# Altium schematic sheet Dual VCO schematic Thijn en Ralph.SchDoc: Dual VCO
size A4; Author: Thijn Berkhoff; DrawnBy: Thijn Berkhoff; SheetNumber: 1; SheetTotal: 1; SPICEModelCacheYZOSSGZK: <root> / <DocumentId>YZOSSGZK</DocumentId> / <CacheFrame Number="0"> / <Model Name="bc847c" Kind="CKT"> / <Text>********************************************************** / * / * BC847C / * / * Nexperia / * / * General purpose NPN transistor / * IC   = 100 mA / * VCEO = 45 V / * hFE  = 420 - 800 @ 5V/2mA / * / * / * / * / * Package pinning does not match Spice model pinning. / * Package: SOT 23 / * / * Package Pin 1: Base / * Package Pin 2: Emitter / * Package Pin 3: Collector / * / * / * Extraction date (week/year): 42/2018 / * Spicemodel includes temperature dependency / * / ********************************************************** / *# / * / * Diode D1, Transistor Q2 and resistor RQ / * are dedicated to improve modeling of quasi / * saturation area and reverse mode operation / * and do not reflect physical devices. / * / .SUBCKT BC847C 1 2 3 / Q1 1 2 3 Transistor 0.9342 / Q2 11 2 3 Transistor 0.0658 / RQ 1 11 662.1 / D1 2 1 Diode / * / .MODEL Transistor NPN / + IS = 1.641E-014 / + NF = 0.9969 / + ISE = 1.151E-016 / + NE = 1.208 / + BF = 509 / + IKF = 0.0863 / + VAF = 66.64 / + NR = 0.9953 / + ISC = 1.068E-014 / + NC = 1.357 / + BR = 9.832 / + IKR = 0.1524 / + VAR = 25 / + RB = 360 / + IRB = 2.5E-005 / + RBM = 0.8 / + RE = 0.6403 / + RC = 0.5461 / + XTB = 1.595 / + EG = 1.11 / + XTI = 6.27 / + CJE = 1.119E-011 / + VJE = 0.6755 / + MJE = 0.3391 / + TF = 5.25E-010 / + XTF = 22.74 / + VTF = 2 / + ITF = 0.368 / + PTF = 0 / + CJC = 3.693E-012 / + VJC = 0.5083 / + MJC = 0.3642 / + XCJC = 1 / + TR = 0.0008 / + CJS = 0 / + VJS = 0.75 / + MJS = 0.333 / + FC = 0.9552 / * / .MODEL Diode D / + IS = 4.418E-016 / + N = 0.9799 / + BV = 1000 / + IBV = 0.001 / + RS = 3460 / + CJO = 0 / + VJ = 1 / + M = 0.5 / + FC = 0 / + TT = 0 / + EG = 1.11 / + XTI = 3 / .ENDS</Text> / </Model> / </CacheFrame> / </root>
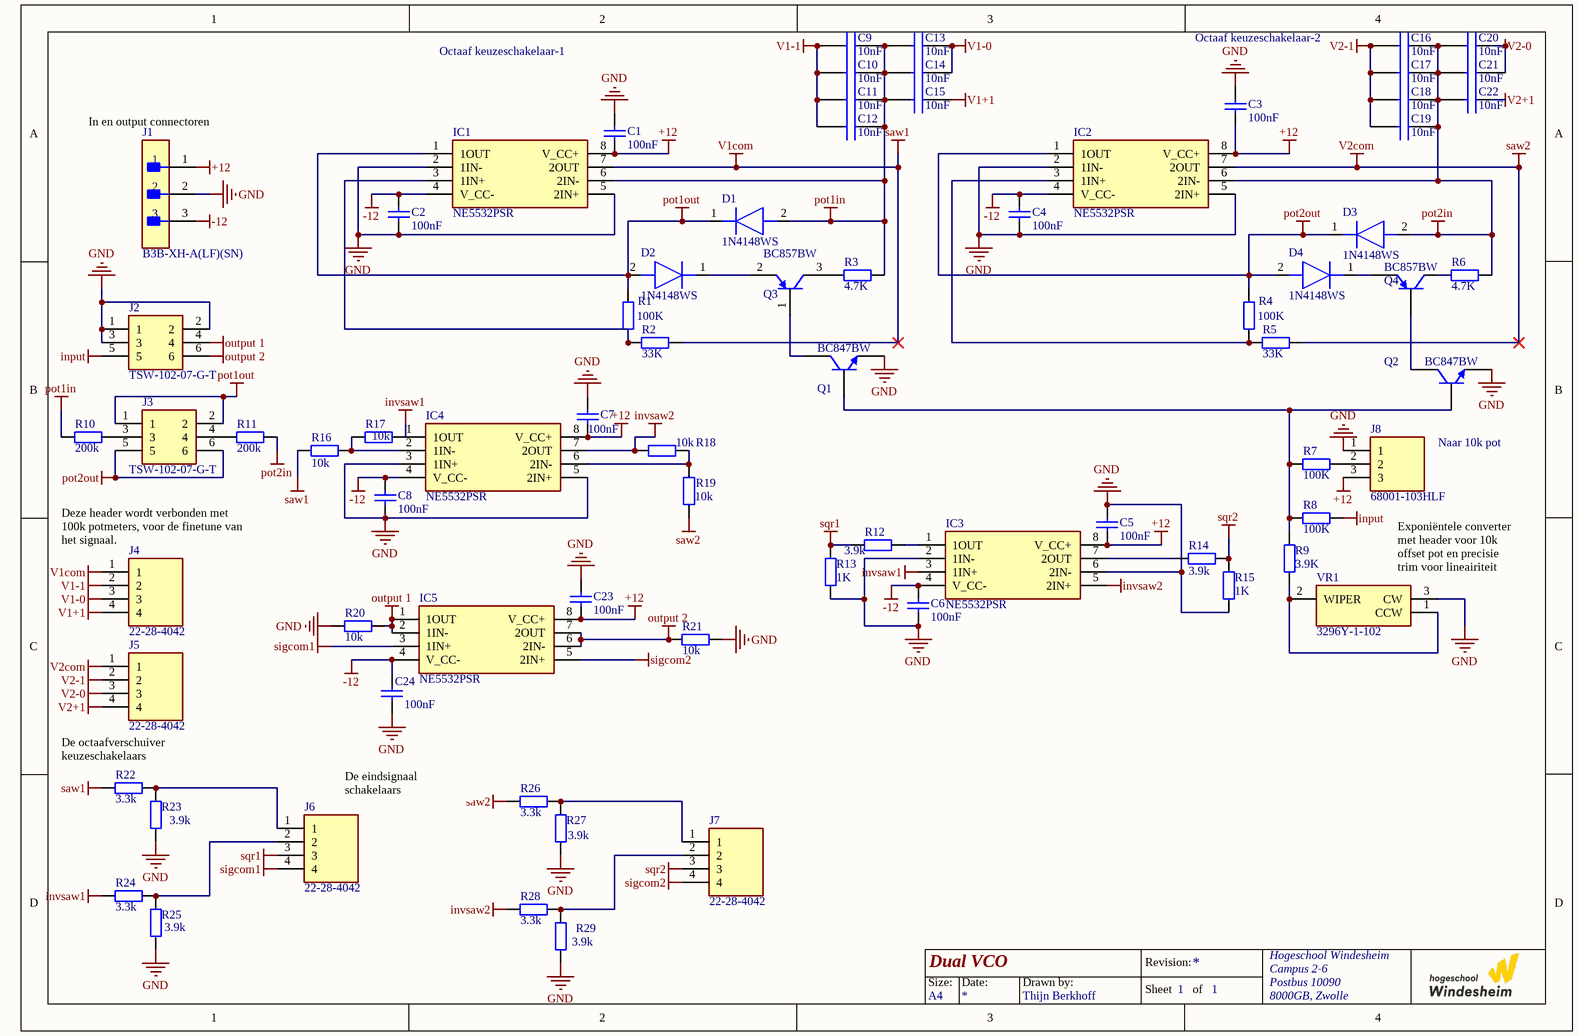
[diagram p0: Dual VCO schematic Thijn en Ralph.SchDoc]

## Parts
C1  100nF  [C1206]
C2  100nF  [C1206]
C3  100nF  [C1206]
C4  100nF  [C1206]
C5  100nF  [C1206]
C6  100nF  [C1206]
C7  100nF  [C1206]
C8  100nF  [C1206]
C9  10nF  [R82MC2100DQ50J]
C10  10nF  [R82MC2100DQ50J]
C11  10nF  [R82MC2100DQ50J]
C12  10nF  [R82MC2100DQ50J]
C13  10nF  [R82MC2100DQ50J]
C14  10nF  [R82MC2100DQ50J]
C15  10nF  [R82MC2100DQ50J]
C16  10nF  [R82MC2100DQ50J]
C17  10nF  [R82MC2100DQ50J]
C18  10nF  [R82MC2100DQ50J]
C19  10nF  [R82MC2100DQ50J]
C20  10nF  [R82MC2100DQ50J]
C21  10nF  [R82MC2100DQ50J]
C22  10nF  [R82MC2100DQ50J]
C23  100nF  [C1206]
C24  100nF  [C1206]
D1  1N4148WS  [SODFL2512X90N]
D2  1N4148WS  [SODFL2512X90N]
D3  1N4148WS  [SODFL2512X90N]
D4  1N4148WS  [SODFL2512X90N]
IC1  NE5532PSR  [SOIC127P780X200-8N]
IC2  NE5532PSR  [SOIC127P780X200-8N]
IC3  NE5532PSR  [SOIC127P780X200-8N]
IC4  NE5532PSR  [SOIC127P780X200-8N]
IC5  NE5532PSR  [SOIC127P780X200-8N]
J1  B3B-XH-A(LF)(SN)  [FP-B3B-XH-A_LF_SN-MFG]
J2  TSW-102-07-G-T  [HDRV6W64P254_3X2_508X762X838P]
J3  TSW-102-07-G-T  [HDRV6W64P254_3X2_508X762X838P]
J4  22-28-4042  [HDRV4W66P0X254_1X4_1016X249X1003P]
J5  22-28-4042  [HDRV4W66P0X254_1X4_1016X249X1003P]
J6  22-28-4042  [HDRV4W66P0X254_1X4_1016X249X1003P]
J7  22-28-4042  [HDRV4W66P0X254_1X4_1016X249X1003P]
J8  68001-103HLF  [68001103HLF]
Q1  BC847BW  [SOT23]
Q2  BC847BW  [SOT23]
Q3  BC857BW  [SOT23]
Q4  BC857BW  [SOT23]
R1  100K  [R1206]
R2  33K  [R1206]
R3  4.7K  [R1206]
R4  100K  [R1206]
R5  33K  [R1206]
R6  4.7K  [R1206]
R7  100K  [R1206]
R8  100K  [R1206]
R9  3.9K  [R1206]
R10  200k  [R1206]
R11  200k  [R1206]
R12  3.9k  [R1206]
R13  1K  [R1206]
R14  3.9k  [R1206]
R15  1K  [R1206]
R16  10k  [R1206]
R17  10k  [R1206]
R18  10k  [R1206]
R19  10k  [R1206]
R20  10k  [R1206]
R21  10k  [R1206]
R22  3.3k  [R1206]
R23  3.9k  [R1206]
R24  3.3k  [R1206]
R25  3.9k  [R1206]
R26  3.3k  [R1206]
R27  3.9k  [R1206]
R28  3.3k  [R1206]
R29  3.9k  [R1206]
VR1  3296Y-1-102  [3296Y1102]

## Nets
+12: C1.1 C3.1 C5.1 C7.1 C23.1 IC1.8(V_CC+) IC2.8(V_CC+) IC3.8(V_CC+) IC4.8(V_CC+) IC5.8(V_CC+) J1.1 J8.3
-12: C2.2 C4.2 C6.2 C8.2 C24.2 IC1.4(V_CC-) IC2.4(V_CC-) IC3.4(V_CC-) IC4.4(V_CC-) IC5.4(V_CC-) J1.3
GND: C1.2 C2.1 C3.2 C4.1 C5.2 C6.1 C7.2 C8.1 C23.2 C24.1 IC1.2(1IN-) IC1.5(2IN+) IC2.2(1IN-) IC2.5(2IN+) IC3.2(1IN-) IC3.6(2IN-) IC4.3(1IN+) IC4.5(2IN+) J1.2 J2.1 J2.2 J2.3 J8.1 Q1.2(E) Q2.2(E) R13.1 R15.1 R20.2 R21.2 R23.1 R25.1 R27.1 R29.1 VR1.3(CW)
input: J2.5 R8.2
invsaw1: IC3.3(1IN+) R17.1 R24.1
invsaw2: IC3.5(2IN+) IC4.7(2OUT) R18.1 R28.1
output 1: IC5.1(1OUT) IC5.2(1IN-) J2.4 R20.1
output 2: IC5.6(2IN-) IC5.7(2OUT) J2.6 R21.1
pot1in: C9.2 C10.2 C11.2 C12.2 C13.2 C14.2 C15.2 D1.2(A) IC1.6(2IN-) R3.2 R10.1
pot1out: D1.1(K) D2.2(A) IC1.1(1OUT) J3.1 J3.2 R1.2
pot2in: C16.2 C17.2 C18.2 C19.2 C20.1 C21.1 C22.1 D3.2(A) IC2.6(2IN-) R6.2 R11.2
pot2out: D3.1(K) D4.2(A) IC2.1(1OUT) J3.5 J3.6 R4.2
saw1: IC1.7(2OUT) J4.1 R2.2 R16.1 R22.1  [also labelled V1com]
saw2: IC2.7(2OUT) J5.1 R5.2 R19.2 R26.1  [also labelled V2com]
sigcom1: IC5.3(1IN+) J6.4
sigcom2: IC5.5(2IN+) J7.4
sqr1: J6.3 R12.1 R13.2
sqr2: J7.3 R14.2 R15.2
V1+1: C15.1 J4.4
V1-0: C13.1 C14.1 J4.3
V1-1: C9.1 C10.1 C11.1 C12.1 J4.2
V2+1: C22.2 J5.4
V2-0: C20.2 C21.2 J5.3
V2-1: C16.1 C17.1 C18.1 C19.1 J5.2
NetD2_1: D2.1(K) Q3.2(E)
NetD4_1: D4.1(K) Q4.2(E)
NetIC1_3: IC1.3(1IN+) R1.1 R2.1
NetIC2_3: IC2.3(1IN+) R4.1 R5.1
NetIC3_1: IC3.1(1OUT) R12.2
NetIC3_7: IC3.7(2OUT) R14.1
NetIC4_2: IC4.2(1IN-) R16.2 R17.2
NetIC4_6: IC4.6(2IN-) R18.2 R19.1
NetJ3_3: J3.3 R10.2
NetJ3_4: J3.4 R11.1
NetJ6_1: J6.1 R22.2 R23.2
NetJ6_2: J6.2 R24.2 R25.2
NetJ7_1: J7.1 R26.2 R27.2
NetJ7_2: J7.2 R28.2 R29.2
NetJ8_2: J8.2 R7.1
NetQ1_1: Q1.1(B) Q2.1(B) R7.2 R8.1 R9.2
NetQ1_3: Q1.3(C) Q3.1(B)
NetQ2_3: Q2.3(C) Q4.1(B)
NetQ3_3: Q3.3(C) R3.1
NetQ4_3: Q4.3(C) R6.1
NetR9_1: R9.1 VR1.1(CCW) VR1.2(WIPER)

Not connected (* = marked no-connect by the designer): IC4 1(1OUT)

## Notes on the sheet
- Octaaf keuzeschakelaar-2
- Octaaf keuzeschakelaar-1
- (near J1) In en output connectoren
- Naar 10k pot
- (near J4) Deze header wordt verbonden met 100k potmeters, voor de finetune van het signaal.
- (near VR1) Exponiëntele converter met header voor 10k offset pot en precisie trim voor lineairiteit instellen
- De octaafverschuiver keuzeschakelaars
- De eindsignaal schakelaars
- Size:
- Date:
- Drawn by:
- Revision:
- Hogeschool Windesheim
- Campus 2-6
- Postbus 10090
- A4
- Sheet
- of
- 8000GB, Zwolle

## Library data of the parts
C1 C3 = Capacitor_1206: SMD Capacitor 1206; Value: 10nF; Published: 03-11-2016; LatestRevisionDate: 03-11-2016; LatestRevisionNote: Creation; PackageReference: C1206; Publisher: Windesheim; PackageDescription: Chip Capacitor, Body 3.2x1.6mm, Height 1.7mm, IPC Medium Density
C2 C4-C8 C23 C24 = Capacitor_1206: SMD Capacitor 1206; Published: 03-11-2016; LatestRevisionDate: 03-11-2016; LatestRevisionNote: Creation; PackageReference: C1206; Publisher: Windesheim; PackageDescription: Chip Capacitor, Body 3.2x1.6mm, Height 1.7mm, IPC Medium Density; Value: 100nF
C9-C22 = R82MC2100DQ50J: folie condensator; Manufacturer_Name: KEMET; Datasheet Link: https://search.kemet.com/component-documentation/download/specsheet/R82MC2100DQ50J; Height: 7.6mm; Manufacturer_Part_Number: R82MC2100DQ50J; Mouser Part Number: 80-R82MC2100DQ50J; Mouser Price/Stock: https://www.mouser.co.uk/ProductDetail/KEMET/R82MC2100DQ50J?qs=Jv4FAWB%252B0HbaB%2FcNVoyM2A%3D%3D
D1-D4 = 1N4148WS: Diode; Manufacturer_Name: onsemi; Height: 0.9mm; Manufacturer_Part_Number: 1N4148WS; Mouser Part Number: 512-1N4148WS; Mouser Price/Stock: https://www.mouser.co.uk/ProductDetail/onsemi-Fairchild/1N4148WS?qs=2%2FYqgE%252BHg%252BKBrKZlAsMLhw%3D%3D; Arrow Part Number: 1N4148WS; Arrow Price/Stock: https://www.arrow.com/en/products/1n4148ws/on-semiconductor?region=europe
IC1-IC5 = NE5532PSR: Integrated Circuit; Manufacturer_Name: Texas Instruments; Datasheet Link: http://www.ti.com/lit/gpn/ne5532; Height: 2mm; Manufacturer_Part_Number: NE5532PSR; Mouser Part Number: 595-NE5532PSR; Mouser Price/Stock: https://www.mouser.co.uk/ProductDetail/Texas-Instruments/NE5532PSR?qs=bkMXpVdiF42odhJUqZo0sQ%3D%3D; Arrow Part Number: NE5532PSR; Arrow Price/Stock: https://www.arrow.com/en/products/ne5532psr/texas-instruments?utm_currency=USD&region=nac
J1 = CMP-17439-000014-3: CONN HEADER VERT 3POS 2.5MM; Max Voltage Rating (DC): 250V; Number of Positions: 3; Current Rating: 3A; Gender: Male; Wire/Cable Gauge: 22AWG; Contact Resistance: 20mR; Insulation Resistance: 1GR; Insulation Material: Nylon; Contact Plating: Tin; Depth: 5.75mm; Contact Type: Male Pin; Max Operating Temperature: 85°C; Insulation Color: Natural; Voltage Rating (AC): 250V; Color: Natural; Connector Type: Header; Orientation: Straight; Fastening Type: Detent; Housing Color: White; Min Operating Temperature: -25°C; Termination: Solder; Voltage Rating: 250V; Series: XH; Pitch: 2.5mm; Contact Shape: Square; Number of Rows: 1; Lead Free: Lead Free; Packaging: Bulk; Mount: Through Hole; Flammability Rating: UL94 V-0; Max Voltage Rating (AC): 250V; REACH SVHC: No SVHC; Housing Material: Polyamide; Contact Material: Brass; Lead Pitch: 2.5mm; Contact Finish - Mating: TIN; Length: 9.9mm; Max Current Rating: 3A; Number of Contacts: 3
J2 J3 = TSW-102-07-G-T: Connector; Manufacturer_Name: SAMTEC; Datasheet Link: http://suddendocs.samtec.com/catalog_english/tsw_th.pdf; Height: 8.38mm; Manufacturer_Part_Number: TSW-102-07-G-T; Mouser Part Number: 200-TSW10207GT; Mouser Price/Stock: https://www.mouser.co.uk/ProductDetail/Samtec/TSW-102-07-G-T?qs=rU5fayqh%252BE0IRH%2FB9eWD2w%3D%3D; Arrow Part Number: TSW-102-07-G-T; Arrow Price/Stock: https://www.arrow.com/en/products/tsw-102-07-g-t/samtec?region=nac
J4-J7 = 22-28-4042: Connector; Manufacturer_Name: Molex; Datasheet Link: https://www.molex.com/content/dam/molex/molex-dot-com/products/automated/en-us/salesdrawingpdf/423/42375/022284042_sd.pdf?inline; Height: 10.03mm; Manufacturer_Part_Number: 22-28-4042; Mouser Part Number: 538-22-28-4042; Mouser Price/Stock: https://www.mouser.co.uk/ProductDetail/Molex/22-28-4042?qs=GAPJcf4kvdu6DqYOOlzdaQ%3D%3D
J8 = 68001-103HLF: Connector; Manufacturer_Name: Amphenol; Datasheet Link: https://cdn.amphenol-cs.com/media/wysiwyg/files/drawing/68000.pdf; Height: 8.58mm; Manufacturer_Part_Number: 68001-103HLF
R1 R4 R13 R15 = Resistor_1206: SMD Resistor 1206; Published: 03-11-2016; LatestRevisionDate: 03-11-2016; LatestRevisionNote: Creation; PackageReference: R1206; Publisher: Windesheim; PackageDescription: Chip Resistor, Body 3.2x1.6mm, IPC Medium Density
  R1 R4: Value: 100K
  R13 R15: Value: 1K
R2 R3 R5-R12 R14 R16-R29 = Resistor_1206: SMD Resistor 1206; Value: 1K; Published: 03-11-2016; LatestRevisionDate: 03-11-2016; LatestRevisionNote: Creation; PackageReference: R1206; Publisher: Windesheim; PackageDescription: Chip Resistor, Body 3.2x1.6mm, IPC Medium Density
VR1 = 3296Y-1-102: Variable Resistor; Manufacturer_Name: Bourns; Datasheet Link: https://www.bourns.com/data/global/pdfs/3296.pdf; Height: 11.8mm; Manufacturer_Part_Number: 3296Y-1-102; Mouser Part Number: 652-3296Y-1-102; Mouser Price/Stock: https://www.mouser.co.uk/ProductDetail/Bourns/3296Y-1-102?qs=DRqqlFaNjzXVgSOsMqUlIA%3D%3D; Arrow Part Number: 3296Y-1-102; Arrow Price/Stock: https://www.arrow.com/en/products/3296y-1-102/bourns?region=nac